# EAGLE design PIC32 (EAGLE 9.3.0)
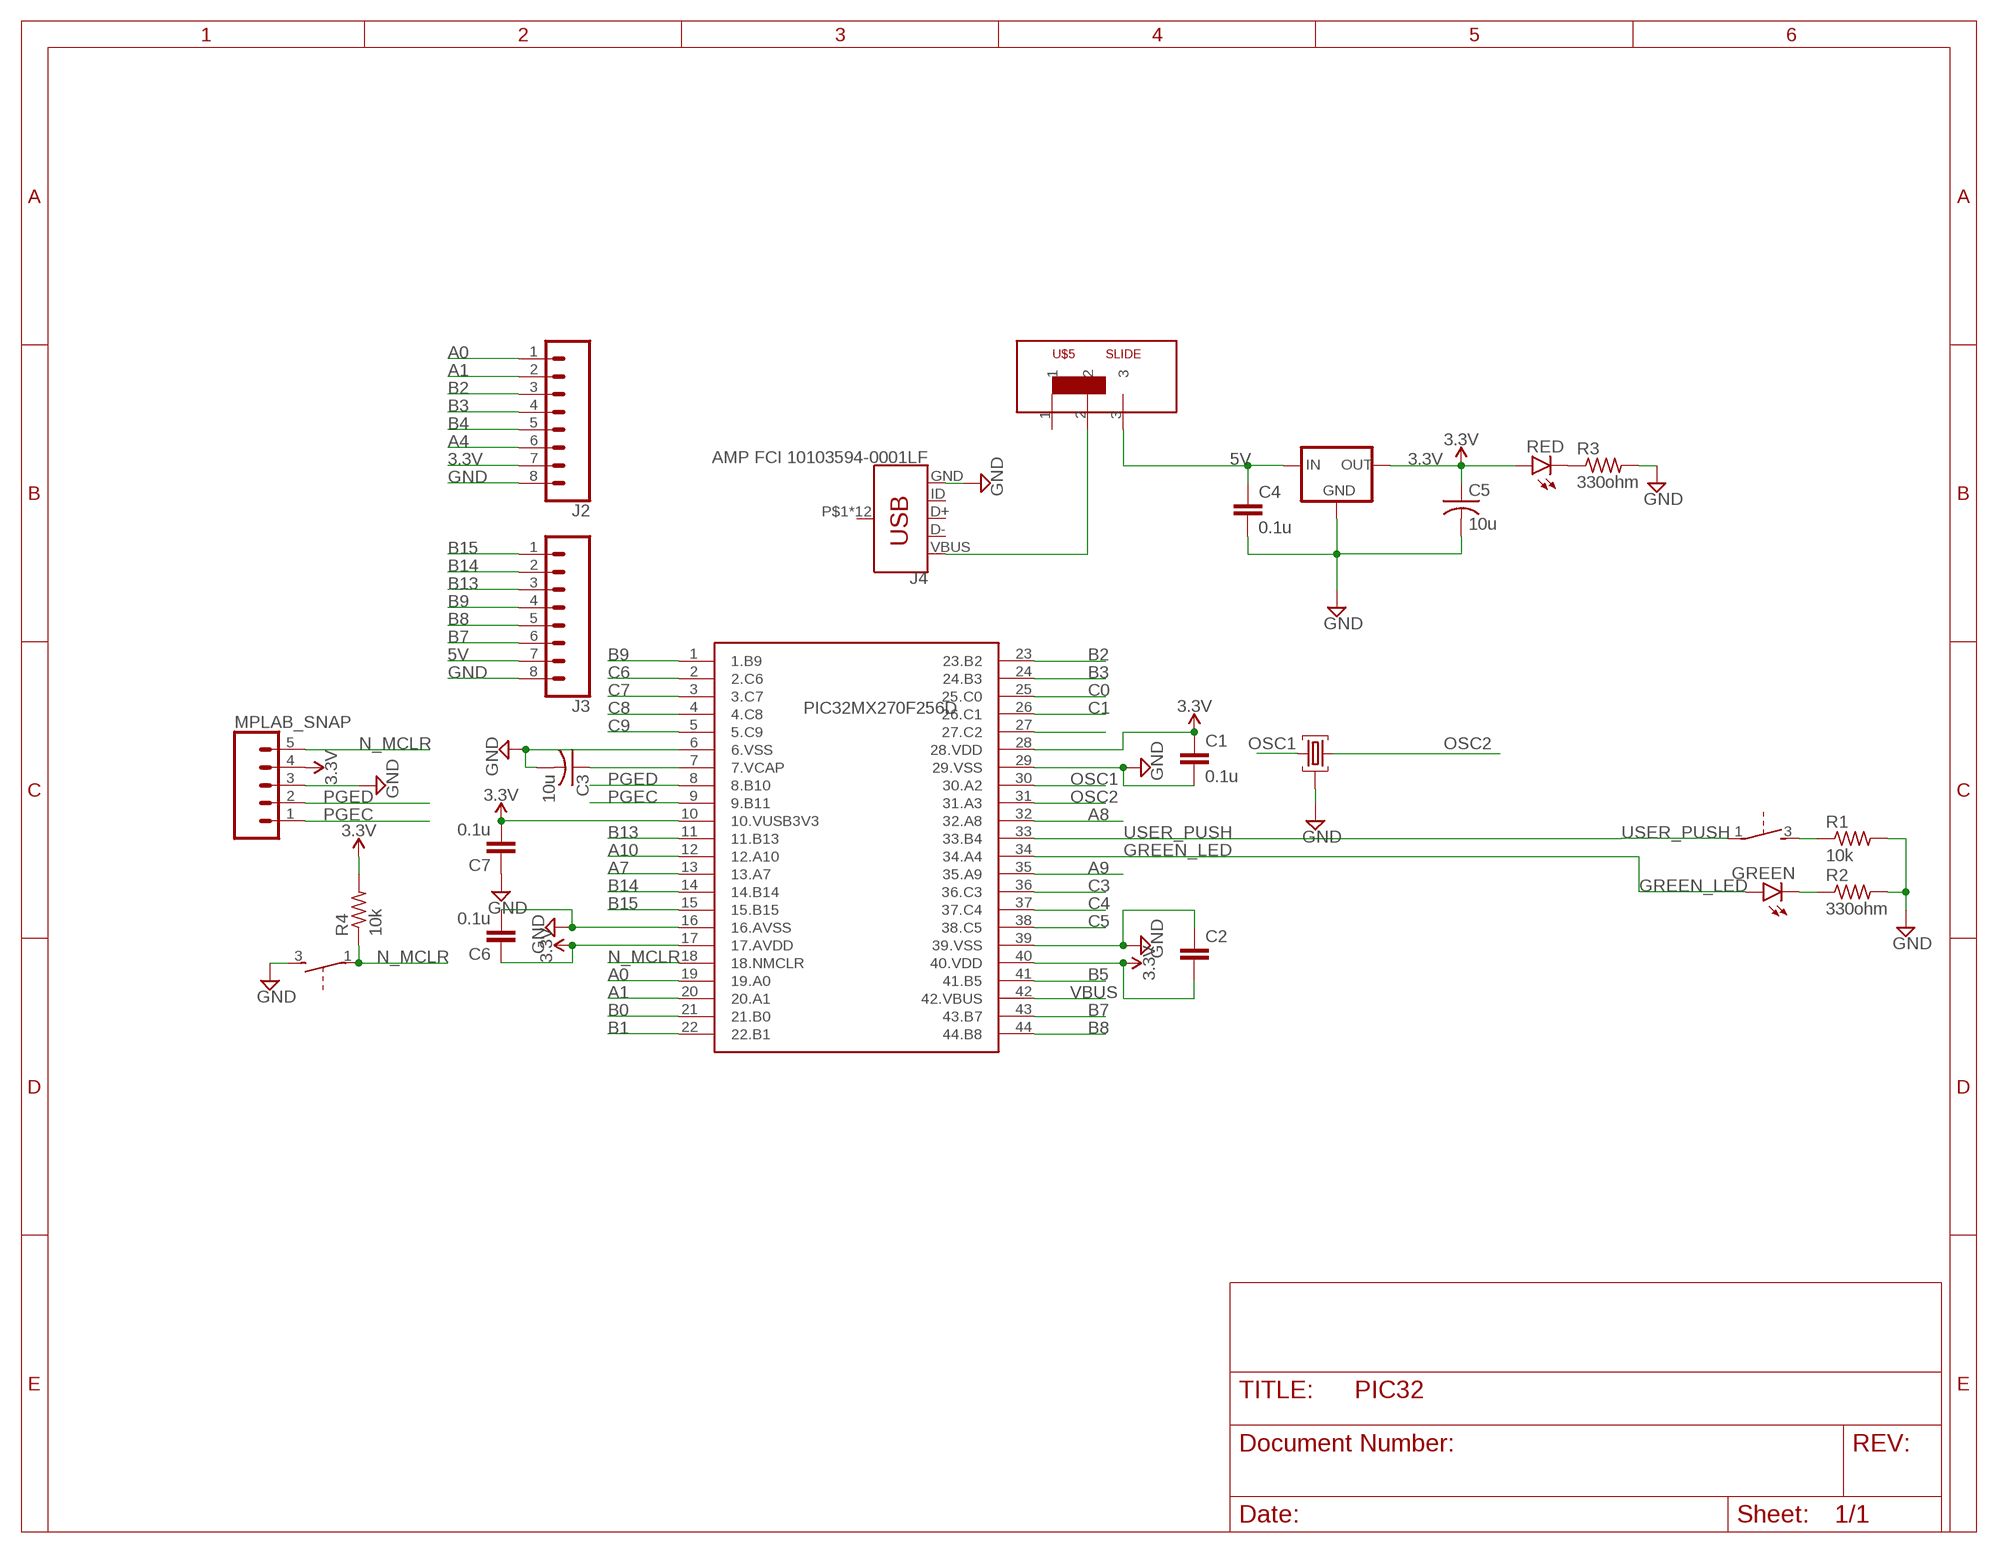
[diagram p0: schematic, sheet 1]

## Parts
C1  0.1u  C2,5-3  [C2.5-3]
C2  C2,5-3  [C2.5-3]
C3  10u  C-US050-045X075  [C050-045X075]
C4  0.1u  C2,5-3  [C2.5-3]
C5  10u  C-US050-045X075  [C050-045X075]
C6  0.1u  C2,5-3  [C2.5-3]
C7  0.1u  C2,5-3  [C2.5-3]
GREEN  LED3MM  [LED3MM]
J2  CONN_08"  [1X08]
J3  CONN_08"  [1X08]
J4  AMP FCI 10103594-0001LF  USB_MICRO-B_HALF_PTH  [USB-MICROB-PTH]
MPLAB_SNAP  CONN_05  [1X05]
R1  10k  R-US_0207/7  [0207/7]
R2  330ohm  R-US_0207/7  [0207/7]
R3  330ohm  R-US_0207/7  [0207/7]
R4  10k  R-US_0207/7  [0207/7]
RED  LED3MM  [LED3MM]
U$1  PIC32MX270F256D  [PIC32MX270F256D]
U$2  8MHZ_XTAL  [8MHZ_XTAL]
U$3  EVQ-11  [EVQ-11]
U$4  L4931  [TO92]
U$5  SLIDE  [SLIDE]
USER_PUSH  EVQ-11  [EVQ-11]

## Nets
3.3V: C1.1 C2.2 C5.1 C6.1 C7.2 J2.7 MPLAB_SNAP.4 R4.2 RED.A U$1.10(10.VUSB3V3) U$1.17(17.AVDD) U$1.28(28.VDD) U$1.40(40.VDD) U$4.VOUT(OUT)
5V: C4.1 J3.7 U$4.VIN(IN) U$5.3
A0: J2.1 U$1.19(19.A0)
A1: J2.2 U$1.20(20.A1)
A4: J2.6
A7: U$1.13(13.A7)
A8: U$1.32(32.A8)
A9: U$1.35(35.A9)
A10: U$1.12(12.A10)
B0: U$1.21(21.B0)
B1: U$1.22(22.B1)
B2: J2.3 U$1.23(23.B2)
B3: J2.4 U$1.24(24.B3)
B4: J2.5
B5: U$1.41(41.B5)
B7: J3.6 U$1.43(43.B7)
B8: J3.5 U$1.44(44.B8)
B9: J3.4 U$1.1(1.B9)
B13: J3.3 U$1.11(11.B13)
B14: J3.2 U$1.14(14.B14)
B15: J3.1 U$1.15(15.B15)
C0: U$1.25(25.C0)
C1: U$1.26(26.C1)
C3: U$1.36(36.C3)
C4: U$1.37(37.C4)
C5: U$1.38(38.C5)
C6: U$1.2(2.C6)
C7: U$1.3(3.C7)
C8: U$1.4(4.C8)
C9: U$1.5(5.C9)
GND: C1.2 C2.1 C3.2 C4.2 C5.2 C6.2 C7.1 J2.8 J3.8 J4.GND MPLAB_SNAP.3 R1.2 R2.2 R3.2 U$1.6(6.VSS) U$1.16(16.AVSS) U$1.29(29.VSS) U$1.39(39.VSS) U$2.2 U$3.3(S) U$4.GND
GREEN_LED: GREEN.A U$1.34(34.A4)
N$3: R1.1 USER_PUSH.3(S)
N$4: GREEN.K(C) R2.1
N$8: R3.1 RED.K(C)
N$10: C3.1 U$1.7(7.VCAP)
N$11: J4.VBUS U$5.2
N$26: U$1.27(27.C2)
N_MCLR: MPLAB_SNAP.5 R4.1 U$1.18(18.NMCLR) U$3.1(P)
OSC1: U$1.30(30.A2) U$2.1
OSC2: U$1.31(31.A3) U$2.3
PGEC: MPLAB_SNAP.1 U$1.9(9.B11)
PGED: MPLAB_SNAP.2 U$1.8(8.B10)
USER_PUSH: U$1.33(33.B4) USER_PUSH.1(P)
VBUS: U$1.42(42.VBUS)
Unconnected: J4.D+ J4.D- J4.ID J4.P$1(SHIELD) J4.P$2(SHIELD) J4.P$3(SHIELD) J4.P$4(SHIELD) J4.P$6(SHIELD) J4.P$8(SHIELD) J4.P$10(SHIELD) J4.P$12(SHIELD) J4.SHEILD2(SHIELD) J4.SHIELD J4.SHIELD3(SHIELD) J4.SHIELD4(SHIELD) U$5.1

## Library data of the parts
C1 C2 C4 C6 C7 = capacitor-wima:C: CAPACITOR naming: grid - package width
C3 C5 = rcl:C-US: CAPACITOR, American symbol; SPICEPREFIX: C
GREEN RED = led:LED: LED OSRAM: - CHIPLED LG R971, LG N971, LY N971, LG Q971, LY Q971, LO R971, LY R971 LH N974, LH R974 LS Q976, LO Q976, LY Q976 LO Q996 - Hyper CHIPLED LW Q18S LB Q993, LB Q99A, LB R99A - SideLED LS A670, LO A670, LY A670, LG A670, LP A670 LB A673, LV A673, LT A673, LW A673 LH A674 LY A675 LS A676, LA A676, LO A676, LY A676, LW A676 LS A679, LY A679, LG A679 - Hyper Micro SIDELED® LS Y876, LA Y876, LO Y876, LY Y876 LT Y87S - SmartLED LW L88C, LW L88S LB L89C, LB L89S, LG L890 LS L89K, LO L89K, LY L89K LS L896, LA L896, LO L896, LY L896 - TOPLED LS T670, LO T670, LY T670, LG T670, LP T670 LSG T670, LSP T670, LSY T670, LOP T670, LYG T670 LG T671, LOG T671, LSG T671 LB T673, LV T673, LT T673, LW T673 LH T674 LS T676, LA T676, LO T676, LY T676, LB T676, LH T676, LSB T676, LW T676 LB T67C, LV T67C, LT T67C, LS T67K, LO T67K, LY T67K, LW E67C LS E67B, LA E67B, LO E67B, LY E67B, LB E67C, LV E67C, LT E67C LW T67C LS T679, LY T679, LG T679 LS T770, LO T770, LY T770, LG T770, LP T770 LB T773, LV T773, LT T773, LW T773 LH T774 LS E675, LA E675, LY E675, LS T675 LS T776, LA T776, LO T776, LY T776, LB T776 LHGB T686 LT T68C, LB T68C - Hyper Mini TOPLED® LB M676 - Mini TOPLED Santana® LG M470 LS M47K, LO M47K, LY M47K Source: http://www.osram.convergy.de LUXEON: - LUMILED® LXK2-PW12-R00, LXK2-PW12-S00, LXK2-PW14-U00, LXK2-PW14-V00 LXK2-PM12-R00, LXK2-PM12-S00, LXK2-PM14-U00 LXK2-PE12-Q00, LXK2-PE12-R00, LXK2-PE12-S00, LXK2-PE14-T00, LXK2-PE14-U00 LXK2-PB12-K00, LXK2-PB12-L00, LXK2-PB12-M00, LXK2-PB14-N00, LXK2-PB14-P00, LXK2-PB14-Q00 LXK2-PR12-L00, LXK2-PR12-M00, LXK2-PR14-Q00, LXK2-PR14-R00 LXK2-PD12-Q00, LXK2-PD12-R00, LXK2-PD12-S00 LXK2-PH12-R00, LXK2-PH12-S00 LXK2-PL12-P00, LXK2-PL12-Q00, LXK2-PL12-R00 Source: www.luxeon.com KINGBRIGHT: KA-3528ASYC Source: www.kingbright.com
J2 J3 = SparkFun-Connectors:CONN_08: Multi connection point. Often used as Generic Header-pin footprint for 0.1 inch spaced/style header connections On any of the 0.1 inch spaced packages, you can populate with these: Break Away Headers - Straight <https://www.sparkfun.com/products/116> (PRT-00116) Break Away Male Headers - Right Angle <https://www.sparkfun.com/products/553> (PRT-00553) Female Headers <https://www.sparkfun.com/products/115> (PRT-00115) Break Away Headers - Machine Pin <https://www.sparkfun.com/products/117> (PRT-00117) Break Away Female Headers - Swiss Machine Pin <https://www.sparkfun.com/products/743> (PRT-00743) Arduino Stackable Header - 8 Pin <https://www.sparkfun.com/products/9279> (PRT-09279) For SCREWTERMINALS and SPRING TERMINALS visit here: Screw Terimnals on SparkFun.com <https://www.sparkfun.com/search/results?term=Screw+Terminals> (5mm/3.5mm/2.54mm spacing) This device is also useful as a general connection point to wire up your design to another part of your project. Our various solder wires solder well into these plated through hole pads. Hook-Up Wire - Assortment (Stranded, 22 AWG) <https://www.sparkfun.com/products/11375> (PRT-11375) Hook-Up Wire - Assortment (Solid Core, 22 AWG) <https://www.sparkfun.com/products/11367> (PRT-11367) View the entire wire category on our website here <https://www.sparkfun.com/categories/141> Special notes: Molex polarized connector foot print use with SKU : PRT-08231 with associated crimp pins and housings. 1MM SMD Version SKU: PRT-10208 NOTES ON THE VARIANTS LOCK and LOCK_LONGPADS... This footprint was designed to help hold the alignment of a through-hole component (i.e. 6-pin header) while soldering it into place. You may notice that each hole has been shifted either up or down by 0.005 of an inch from it's more standard position (which is a perfectly straight line). This slight alteration caused the pins (the squares in the middle) to touch the edges of the holes. Because they are alternating, it causes a "brace" to hold the component in place. 0.005 has proven to be the perfect amount of "off-center" position when using our standard breakaway headers. Although looks a little odd when you look at the bare footprint, once you have a header in there, the alteration is very hard to notice. Also,if you push a header all the way into place, it is covered up entirely on the bottom side.; PROD_ID: CONN-08438
J4 = SparkFun-Connectors:USB_MICRO-B: USB Type Micro-B Connector Male/female and PTH/SMT variants SparkFun Products: SparkFun microB USB Breakout <https://www.sparkfun.com/products/12035> SparkFun USB microB Plug Breakout <https://www.sparkfun.com/products/10031> SparkFun ESP8266 Thing <https://www.sparkfun.com/products/13231>; PROD_ID: CONN-13711
MPLAB_SNAP = SparkFun-Connectors:CONN_05: Multi connection point. Often used as Generic Header-pin footprint for 0.1 inch spaced/style header connections On any of the 0.1 inch spaced packages, you can populate with these: Break Away Headers - Straight <https://www.sparkfun.com/products/116> (PRT-00116) Break Away Male Headers - Right Angle <https://www.sparkfun.com/products/553> (PRT-00553) Female Headers <https://www.sparkfun.com/products/115> (PRT-00115) Break Away Headers - Machine Pin <https://www.sparkfun.com/products/117> (PRT-00117) Break Away Female Headers - Swiss Machine Pin <https://www.sparkfun.com/products/743> (PRT-00743) For SCREWTERMINALS and SPRING TERMINALS visit here: Screw Terimnals on SparkFun.com <https://www.sparkfun.com/search/results?term=Screw+Terminals> (5mm/3.5mm/2.54mm spacing) This device is also useful as a general connection point to wire up your design to another part of your project. Our various solder wires solder well into these plated through hole pads. Hook-Up Wire - Assortment (Stranded, 22 AWG) <https://www.sparkfun.com/products/11375> (PRT-11375) Hook-Up Wire - Assortment (Solid Core, 22 AWG) <https://www.sparkfun.com/products/11367> (PRT-11367) View the entire wire category on our website here <https://www.sparkfun.com/categories/141> Special notes: Molex polarized connector foot print use with SKU : PRT-08231 with associated crimp pins and housings. 1MM SMD Version SKU: PRT-10208
R1-R4 = rcl:R-US_: RESISTOR, American symbol; SPICEPREFIX: R
U$1 = ME433:PIC32MX270F256D
U$2 = ME433:8MHZ_XTAL
U$3 USER_PUSH = ME433:EVQ-11
U$4 = ME433:L4931
U$5 = ME433:SLIDE

## Board
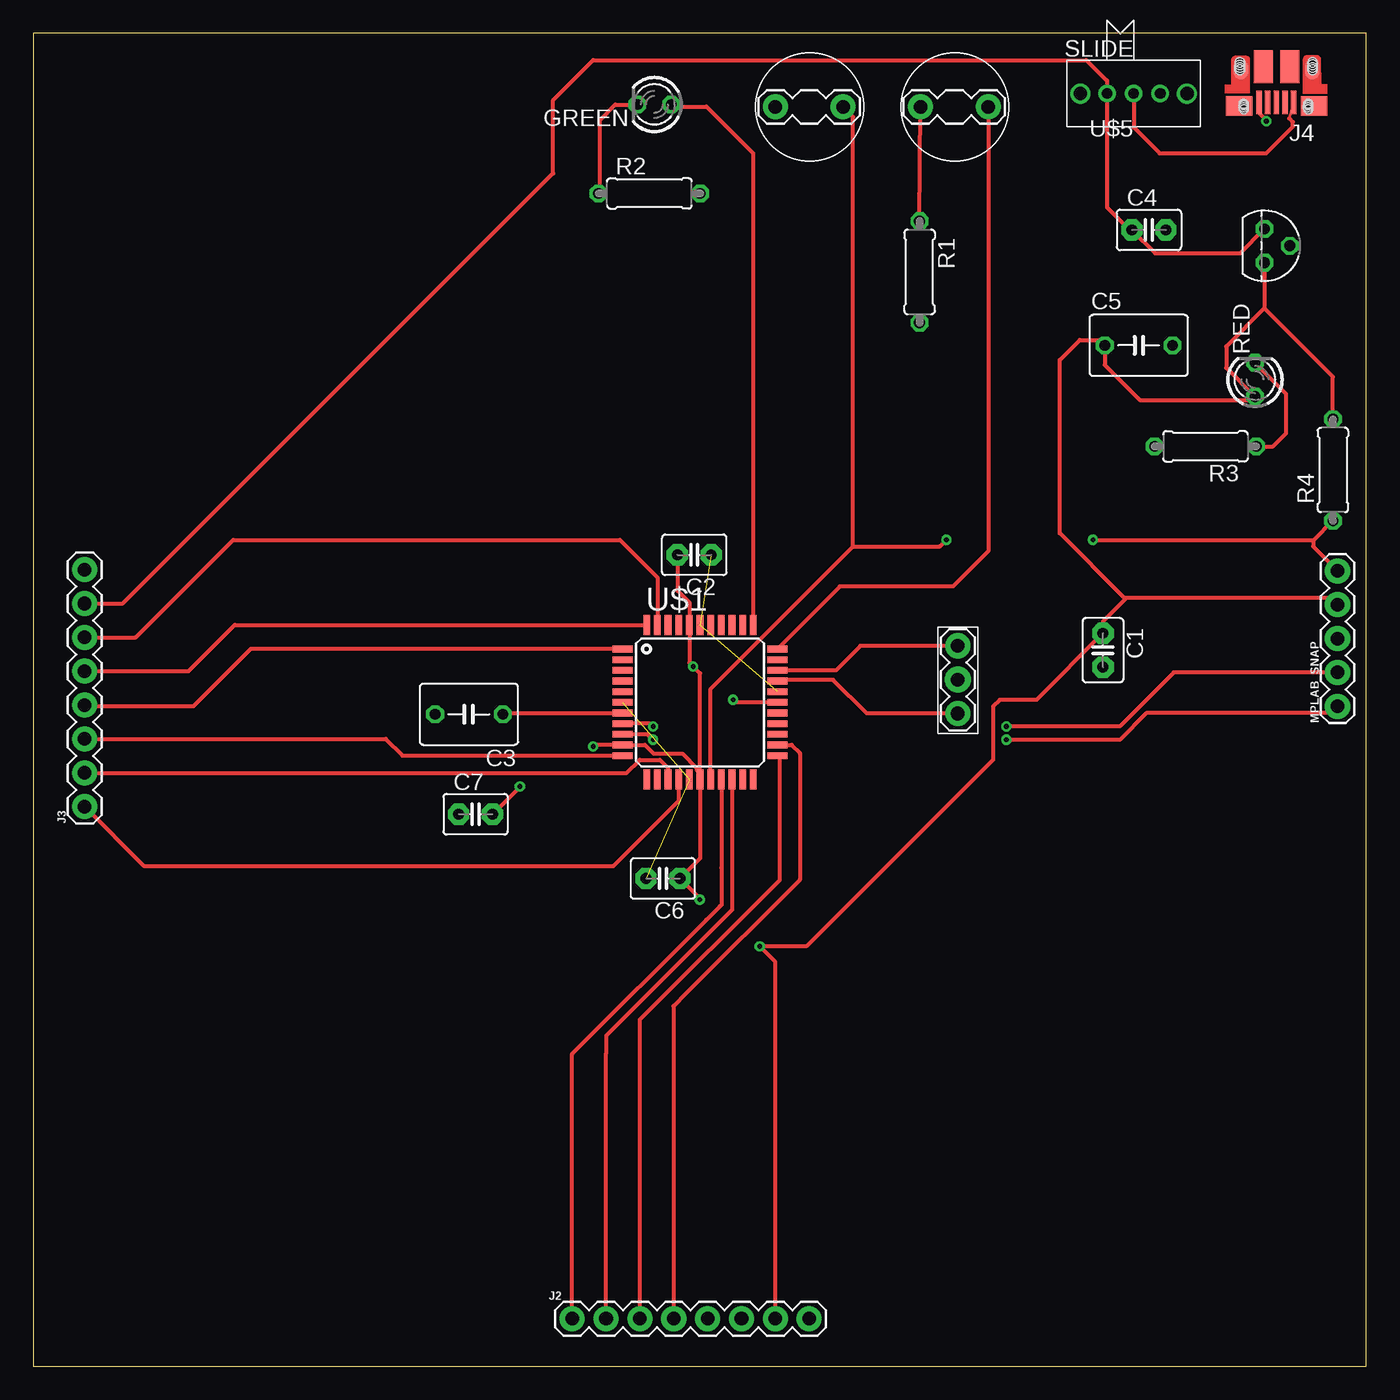
[diagram p1: board, top side]
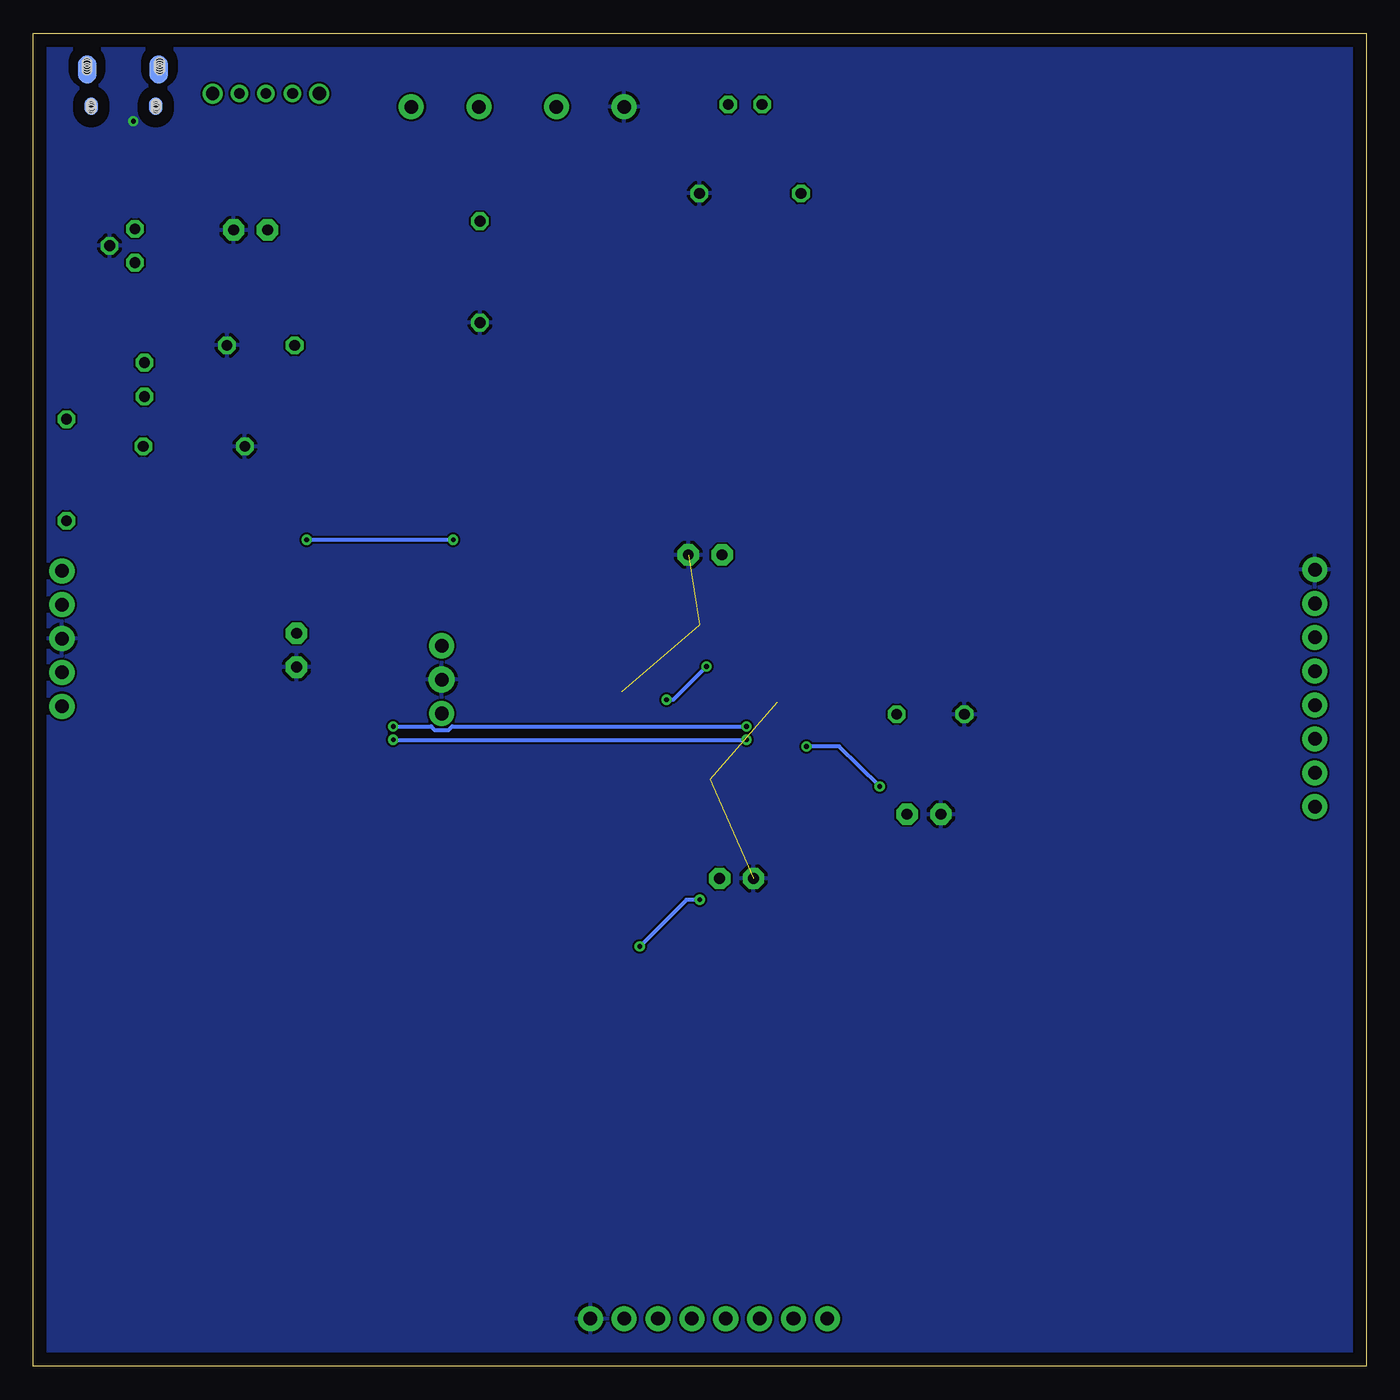
[diagram p2: board, bottom side, seen from below]

Size 100 x 100 mm. Coordinates in mm from the lower left corner, seen from the top.
Outline: 0,0 100,0 100,100 0,100 0,0
Copper layers (1*16): Top 0.035mm / dielectric 1.5mm / Bottom 0.035mm
Design rules "default": minimum track width 6mil, minimum drill 0.35mm, track to track 6mil, track to pad 6mil, pad to pad 6mil, via to via 6mil, smd to smd 6mil, copper to edge 40mil, drill to drill 6mil, minimum pad ring 10mil, minimum via ring 8mil, stop-mask expansion 4mil, vias tented up to drill 0mil, thermal gap 10mil

### Footprints (pad centres in the part's own frame; a part is rotated, then mirrored left to right if it is on the bottom)
C2.5-3 = drill 0.813 pad 1.6 octagon: 1 -1.27,0; 2 1.27,0
C050-045X075 = drill 0.813 octagon: 1 -2.54,0; 2 2.54,0
LED3MM = drill 0.813 octagon: A -1.27,0; K 1.27,0
1X08 = drill 1.016 pad 1.88: 1 0,0; 2 2.54,0; 3 5.08,0; 4 7.62,0; 5 10.16,0; 6 12.7,0; 7 15.24,0; 8 17.78,0
USB-MICROB-PTH = smd 0.4 x 1.75: D+ 0.031,1.331; D- -0.619,1.331; GND 1.331,1.331; ID 0.681,1.331; VBUS -1.269,1.331 | smd 1.4 x 2.1 bottom: P$1 2.701,-1.142; P$3 -2.659,-1.144 | smd 1 x 1.3: P$2 2.487,1.594; P$6 -2.368,1.604 | smd 1 x 1.3 bottom: P$4 -2.368,1.604; P$10 2.481,1.598 | smd 1.1 x 1.5: P$8 2.701,-1.142; P$12 -2.659,-1.144 | smd 2 x 1.46: SHEILD2 2.831,1.606; SHIELD -2.794,1.606 | smd 1.425 x 2.5: SHIELD3 -0.979,-1.349; SHIELD4 0.996,-1.352 | hole 0.7: -2.693,-1.134; -2.693,-1.3; -2.694,-1.499; -2.694,-1.664; 2.768,-1.134; 2.767,-1.303; 2.766,-1.496; 2.766,-1.664 | hole 0.66: -2.359,1.821; -2.349,1.691; -2.359,1.541; -2.354,1.432; 2.481,1.821; 2.491,1.691; 2.481,1.541; 2.486,1.432
1X05 = drill 1.016 pad 1.88: 1 0,0; 2 2.54,0; 3 5.08,0; 4 7.62,0; 5 10.16,0
0207/7 = drill 0.813 octagon: 1 -3.81,0; 2 3.81,0
PIC32MX270F256D = smd 1.5 x 0.5: 1 -5.8,4; 2 -5.8,3.2; 3 -5.8,2.4; 4 -5.8,1.6; 5 -5.8,0.8; 6 -5.8,0; 7 -5.8,-0.8; 8 -5.8,-1.6; 9 -5.8,-2.4; 10 -5.8,-3.2; 11 -5.8,-4; 23 5.8,-4; 24 5.8,-3.2; 25 5.8,-2.4; 26 5.8,-1.6; 27 5.8,-0.8; 28 5.8,0; 29 5.8,0.8; 30 5.8,1.6; 31 5.8,2.4; 32 5.8,3.2; 33 5.8,4 | smd 0.5 x 1.5: 12 -4,-5.8; 13 -3.2,-5.8; 14 -2.4,-5.8; 15 -1.6,-5.8; 16 -0.8,-5.8; 17 0,-5.8; 18 0.8,-5.8; 19 1.6,-5.8; 20 2.4,-5.8; 21 3.2,-5.8; 22 4,-5.8; 34 4,5.8; 35 3.2,5.8; 36 2.4,5.8; 37 1.6,5.8; 38 0.8,5.8; 39 0,5.8; 40 -0.8,5.8; 41 -1.6,5.8; 42 -2.4,5.8; 43 -3.2,5.8; 44 -4,5.8
8MHZ_XTAL = drill 1.016 pad 1.88: 1 -2.5,0; 3 2.58,0 | drill 1 pad 1.93: 2 0.04,0
EVQ-11 = drill 1.016 pad 1.88: 1 0,0; 3 5.08,0
TO92 = drill 0.813 octagon: GND 0,1.905; VIN -1.27,0; VOUT 1.27,0
SLIDE = drill 0.8: 1 -2,0; 2 0,0; 3 2,0 | drill 1: P$1 4,0; P$2 -4,0

### Placement (x,y rotation side)
C1  80.25,53.72 270 top
C2  49.59,60.87 180 top
C3  32.68,48.91 180 top
C4  83.7,85.25 0 top
C5  82.93,76.59 0 top
C6  47.24,36.59 180 top
C7  33.18,41.41 0 top
GREEN  46.59,94.66 180 top
J2  40.43,3.57 0 top
J3  3.85,41.98 90 top
J4  93.29,96.14 180 top
MPLAB_SNAP  97.85,49.51 90 top
R1  66.49,82.1 270 top
R2  46.22,87.99 0 top
R3  87.94,69.01 180 top
R4  97.51,67.24 90 top
RED  91.66,74.02 90 top
U$1  50.02,49.81 0 top
U$2  69.36,51.47 90 top
U$3  60.75,94.48 180 top
U$4  92.37,84.06 270 top
U$5  82.55,95.48 180 top
USER_PUSH  71.64,94.48 180 top

### Tracks (layer width: path | path; a pad name or v marks a point on that pad's centre or on a via)
3.3V  (via drill 0.35)
  Top 0.305: U$4.VOUT 92.37,79.37 | 92.37,79.37 89.5,76.5 89.5,74.91 RED.A 91.41,72.5 83,72.5 80.39,75.11 C5.1 80,76.98 80,77 78.5,77 77,75.5 77,62.5 81.87,57.63 82,57.63 | MPLAB_SNAP.4 97.35,57.63 82,57.63 | 82,57.63 80.25,55.88 C1.1 75.26,50 72.5,50 72,49.5 72,45.5 58,31.5 v54.5,31.5 55.67,30.33 J2.7 | C2.2 48.32,58.18 49.22,57.28 U$1.40 49.22,52.78 v49.5,52.5 50.02,51.98 50.02,44.5 | v50,35 50,35.1 C6.1 50.02,38.1 U$1.17 50.02,44.5 | v42,46.5 42.11,46.61 U$1.10 45.89,46.61 46.54,45.96 48.7,45.96 49.77,44.89 49.77,44.74 50.02,44.5 | R4.2 97.51,74.23 92.37,79.37 | U$1.28 52.69,49.81 v52.5,50 | C7.2 36.5,43.46 v36.5,43.5
  Bottom 0.305: v50,35 51,35 v54.5,31.5 | v42,46.5 39.54,46.5 v36.5,43.5 | v49.5,52.5 52,50 v52.5,50
5V
  Top 0.305: J3.7 6.72,57.22 39,89.5 39,95 42,98 79,98 80.55,96.45 U$5.3 80.55,86.95 82.25,85.25 C4.1 84.18,83.5 90.54,83.5 U$4.VIN
A0
  Top 0.305: U$1.19 51.62,37.38 51.63,37.37 51.63,34.63 51.5,34.5 50.5,33.5 40.43,23.43 J2.1
A1
  Top 0.305: J2.2 42.97,23.47 | 42.97,23.47 43,23.5 | U$1.20 52.42,34.24 43.09,24.91 42.98,24.8 42.97,24.79 42.97,23.47
B2
  Top 0.305: J2.3 45.51,26.01 56,36.5 56,45.63 U$1.23
B3
  Top 0.305: U$1.24 56.89,46.61 57.5,46 57.5,36.5 49,28 48.05,27.05 | 48.05,27.05 48,27 | J2.4 48.05,27.05
B7
  Top 0.305: J3.6 7.68,54.68 15,62 44,62 46.82,59.18 U$1.43
B8
  Top 0.305: J3.5 11.64,52.14 15.11,55.61 U$1.44
B9
  Top 0.305: U$1.1 16.31,53.81 12,49.5 3.95,49.5 J3.4
B13
  Top 0.305: J3.3 26.44,47.06 27.69,45.81 U$1.11
B14
  Top 0.305: J3.2 44.52,44.52 45.5,45.5 47,45.5 47.62,44.88 U$1.14
B15
  Top 0.305: U$1.15 48.42,42.42 43.5,37.5 8.33,37.5 J3.1
GND  (via drill 0.35)  (4 unrouted)
  Top 0.305: J4.GND 91.96,94.04 92.5,93.5 v92.5,93.4
  pour Bottom: 0,100 100,100 100,90 100,0 81,0 0,0 0,7
GREEN_LED
  Top 0.305: GREEN.A 48.02,94.5 50.5,94.5 54,91 54,55.63 U$1.34
N$3
  Top 0.305: R1.1 USER_PUSH.3
N$4
  Top 0.305: GREEN.K 43.66,94.66 42.5,93.5 42.5,88.08 R2.1
N$8
  Top 0.305: RED.K 94,72.95 94,70 93.01,69.01 R3.1
N$10
  Top 0.305: C3.1 35.32,49.01 U$1.7
N$11
  Top 0.2: J4.VBUS 94.22,93.63
  Top 0.305: U$5.2 82.55,92.95 84.5,91 92.5,91 94.5,93 94.5,93.35 94.22,93.63
N_MCLR  (via drill 0.35)
  Top 0.305: U$1.18 50.82,50.82 61.5,61.5 | 61.5,61.5 61.5,93.73 U$3.1 | MPLAB_SNAP.5 96.02,61.5 96.02,61.94 | R4.1 96.02,61.94 | 96.02,61.94 79.56,61.94 v79.5,62 | 61.5,61.5 68,61.5 v68.5,62
  Bottom 0.305: v68.5,62 v79.5,62
OSC1
  Top 0.305: U$2.1 62.53,48.97 60,51.5 55.91,51.5 U$1.30
OSC2
  Top 0.305: U$2.3 62.05,54.05 60.21,52.21 U$1.31
PGEC  (via drill 0.35)
  Top 0.305: MPLAB_SNAP.1 97.34,49 83.5,49 81.5,47 v73,47 | v46.5,47 46.09,47.41 U$1.9
  Bottom 0.305: v73,47 v46.5,47
PGED  (via drill 0.35)
  Top 0.305: MPLAB_SNAP.2 85.55,52.05 81.5,48 v73,48 | v46.5,48 46.29,48.21 U$1.8
  Bottom 0.305: v73,48 70.15,48 69.88,47.73 68.84,47.73 68.57,48 v46.5,48
USER_PUSH
  Top 0.305: USER_PUSH.1 71.64,61.14 69,58.5 60.51,58.5 U$1.33